# EAGLE design Pi-LPF (EAGLE 7.7.0)
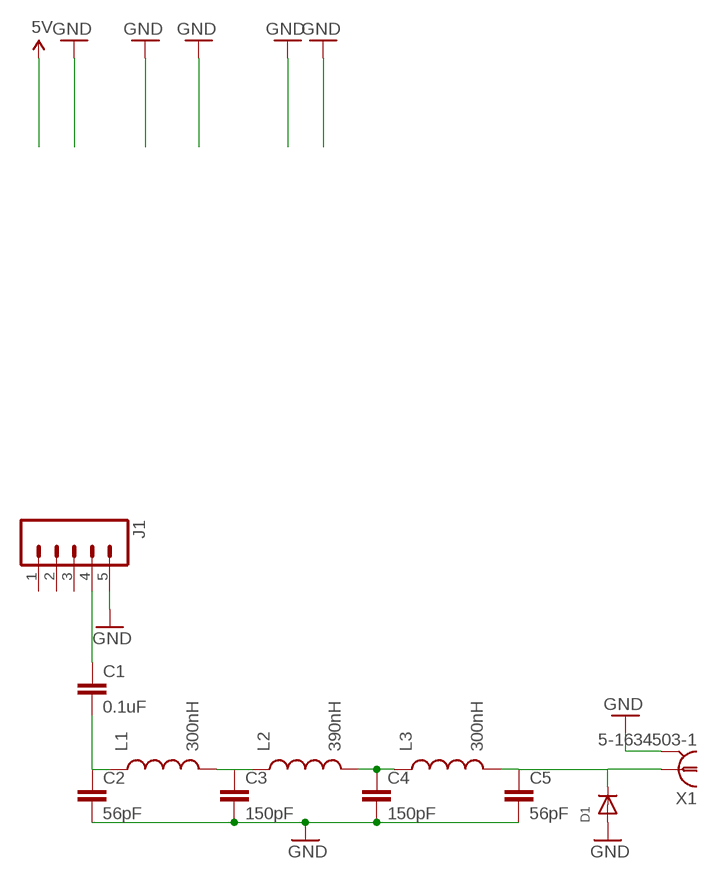
[diagram p0: schematic, sheet 1]

## Parts
C1  0.1uF  CAP1206  [1206]
C2  56pF  CAP1206  [1206]
C3  150pF  CAP1206  [1206]
C4  150pF  CAP1206  [1206]
C5  56pF  CAP1206  [1206]
D1  250mA/100V  DIODESOD-523  [SOD-523]
J1  M05PTH  [1X05]
L1  300nH  INDUCTOR0603  [0603]
L2  390nH  INDUCTOR1206H*  [INDUCTOR-1206]
L3  300nH  INDUCTOR0603  [0603]
X1  5-1634503-1  BN35N61  [B35N61]

## Nets
GND [GND]: C2.2 C3.2 C4.2 C5.2 D1.A J1.5 X1.2 X1.3 X1.4 X1.5
N$1: C3.1 L1.2 L2.P$1
N$2: C4.1 L2.P$2 L3.1
N$3: C1.2 C2.1 L1.1
N$4: C5.1 D1.K(C) L3.2 X1.1
N$5: C1.1 J1.4
Unconnected: J1.1 J1.2 J1.3

## Library data of the parts
C1 = SparkFun-Capacitors:CAP: Capacitor Standard 0603 ceramic capacitor, and 0.1" leaded capacitor.; MPN: 12061C104JAT2A
C2 C5 = SparkFun-Capacitors:CAP: Capacitor Standard 0603 ceramic capacitor, and 0.1" leaded capacitor.; MPN: 12061A560JAT2A
C3 C4 = SparkFun-Capacitors:CAP: Capacitor Standard 0603 ceramic capacitor, and 0.1" leaded capacitor.; MPN: 12062A151JAT2A
D1 = adafruit:DIODE: Diode SMADIODE - SMA Surface Mount Package 20V 1A Schottky Diode Digikey: 641-1014-6-ND DO-1N4148 - Through Hole Small Current Diode SOD-123 20V 1 A (.5mV Vf) Schottky Diode - Digikey: MBRX120TPMSCT-ND SOD-323 10V 570mA (.38mV Vf, 3ns) Schottky Diode - Digikey: ZLLS410CT-ND SOD-523 30V 30mA Schottky Diode (RB751S-40TE61) - Digikey: RB751S-40TE61CT-ND SOT23-R/W - SOT23 Package (R = Solder Paste/Reflow Ovens, W = Hand-Soldering) BAT54Film 40V 300mA - Digikey: 497-7162-1-ND; MPN: ESD8351XV2T1G
J1 = SparkFun-Connectors:M05: Header 5 Standard 5-pin 0.1" header. Use with straight break away headers (SKU : PRT-00116), right angle break away headers (PRT-00553), swiss pins (PRT-00743), machine pins (PRT-00117), and female headers (PRT-00115). Molex polarized connector foot print use with SKU : PRT-08230 with associated crimp pins and housings.
L1 L3 = SparkFun-Passives:INDUCTOR: Inductors Basic Inductor/Choke - 0603 and 1206. Footprints are not proven and vary greatly between part numbers. INDUCTOR POWER 3.3UH 4.0A SMD 0.197" L x 0.197" W x 0.177" H (5.00mm x 5.00mm x 4.50mm); MPN: 0603HP-R30X_LU
L2 = SparkFun-Passives:INDUCTOR: Inductors Basic Inductor/Choke - 0603 and 1206. Footprints are not proven and vary greatly between part numbers. INDUCTOR POWER 3.3UH 4.0A SMD 0.197" L x 0.197" W x 0.177" H (5.00mm x 5.00mm x 4.50mm); MPN: 1206CS-391XGLB
X1 = puggleboard:BN35N61: BNC CONNECTOR M/A COM www.macom.com distributor Farnell 149-452; DK: A97581-ND; MF: TE Connectivity; MPN: 5-1634503-1; OC_FARNELL: unknown; OC_NEWARK: unknown

## Net classes
1 GND: width 0.17 mm, drill 0.33 mm, clearance 0.17 mm to class 0

## Board
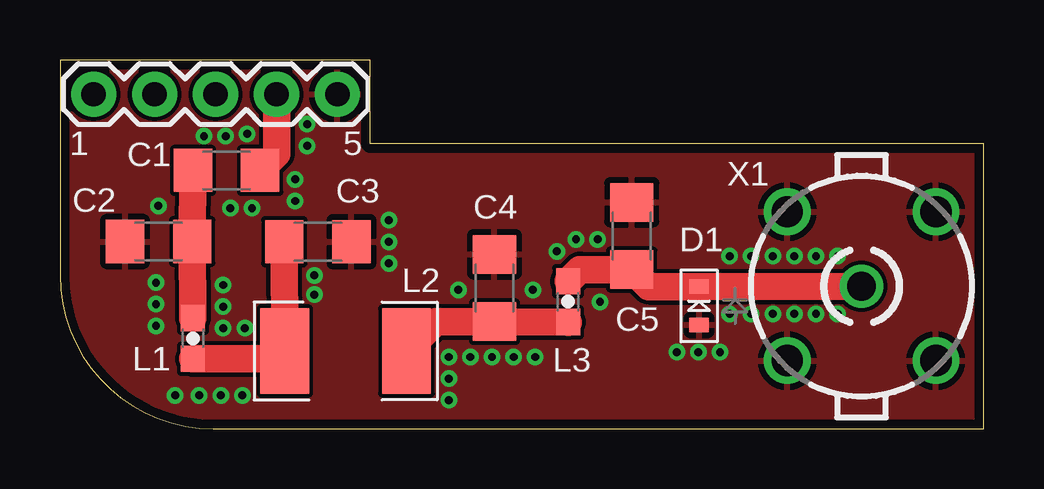
[diagram p1: board, top side]
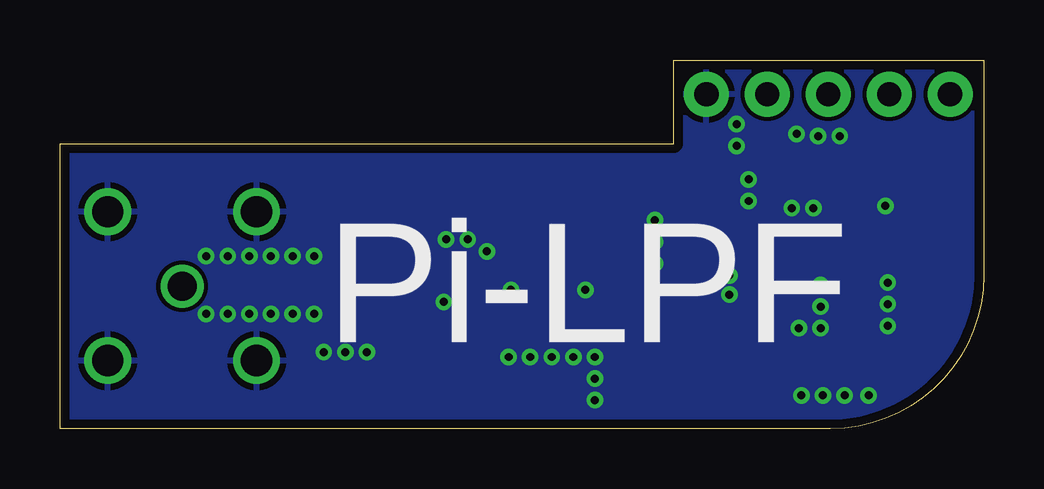
[diagram p2: board, bottom side, seen from below]

Size 38.49 x 15.36 mm. Coordinates in mm from the lower left corner, seen from the top.
Outline: 0,15.36 0,6.39 arc90 6.39,0 38.49,0 38.49,11.87 12.93,11.87 12.93,15.36 0,15.36
Copper layers (1*16): Top 0.0356mm / dielectric 1.5011mm / Bottom 0.0356mm
Design rules "PCBs_io": minimum track width 6mil, minimum drill 13mil, track to track 6mil, track to pad 6mil, pad to pad 6mil, via to via 6mil, smd to smd 6mil, copper to edge 15mil, drill to drill 6mil, minimum pad ring 7mil, minimum via ring 7mil, stop-mask expansion 3mil, vias tented up to drill 0mil, thermal gap 10mil

### Footprints (pad centres in the part's own frame; a part is rotated, then mirrored left to right if it is on the bottom)
1206 = smd 1.6 x 1.8: 1 -1.4,0; 2 1.4,0
SOD-523 = smd 0.8 x 0.6: A 0,-0.8; K 0,0.8
1X05 = drill 1.016 pad 1.88: 1 0,0; 2 2.54,0; 3 5.08,0; 4 7.62,0; 5 10.16,0
0603 = smd 1.1 x 1: 1 -0.85,0; 2 0.85,0
INDUCTOR-1206 = smd 2.032 x 3.556: P$1 -2.54,0; P$2 2.54,0
B35N61 = drill 1.2: 1 0,0 | drill 1.3: 2 3.099,3.099; 3 -3.099,3.099; 4 -3.099,-3.099; 5 3.099,-3.099

### Placement (x,y rotation side)
C1  6.94,10.77 180 top
C2  4.11,7.8 180 top
C3  10.75,7.79 0 top
C4  18.1,5.86 90 top
C5  23.82,8.04 90 top
D1  26.62,5.12 0 top
J1  1.4,13.94 0 top
L1  5.54,3.77 270 top
L2  11.9,3.24 0 top
L3  21.18,5.29 90 top
X1  33.4,5.94 90 top

### Tracks (layer width: path | path; a pad name or v marks a point on that pad's centre or on a via)
GND  (via drill 0.33)
  other vias: 4,6.09 10.3,12.69 10.3,11.79 9.8,10.39 9.8,9.49 8,9.19 7.1,9.19 6.8,5.99 6.8,5.09 6.8,4.19 7.7,4.19 4,5.19 4,4.29 7.6,1.39 6.7,1.39 5.8,1.39 4.8,1.39 10.6,6.39 16.2,2.99 17.1,2.99 18,2.99 18.9,2.99 19.8,2.99 16.2,2.09 19.7,5.79 16.6,5.79 22.5,5.29 27.9,4.79 28.8,4.79 29.7,4.79 30.6,4.79 31.5,4.79 32.4,4.79 22.4,7.89 21.5,7.89 20.7,7.39 4.1,9.29 7.8,12.29 6.9,12.19 6,12.19 27.9,7.19 28.8,7.19 29.7,7.19 30.6,7.19 31.5,7.19 32.4,7.19 13.7,8.69 13.7,7.79 13.7,6.89 16.2,1.19 10.6,5.59 25.7,3.19 26.6,3.19 27.5,3.19
  pour Top (isolate 0.17): -9.5,20.09 -9.5,-11.41 58.5,-11.41 58.5,20.09
  pour Bottom (isolate 0.17): -21.5,21.59 -21.5,-11.41 59.5,-11.41 59.5,21.59
N$1
  Top 1.15: L1.2 8.94,2.91 L2.P$1 C3.1
N$2
  Top 1.15: L2.P$2 15.66,4.46 C4.1 L3.1
N$3
  Top 1.15: C1.2 C2.1 L1.1
N$4
  Top 1.15: L3.2 21.66,6.64 C5.1 24.53,5.93 D1.K X1.1
N$5
  Top 1.15: C1.1 9.04,11.46 9.04,13.92 J1.4

### Text on the board
tNames: 1 | 5
bNames: Pi-LPF